# Altium schematic sheet DIGITAL_PART.SchDoc
size A3; SheetNumber: 1; SheetTotal: 2
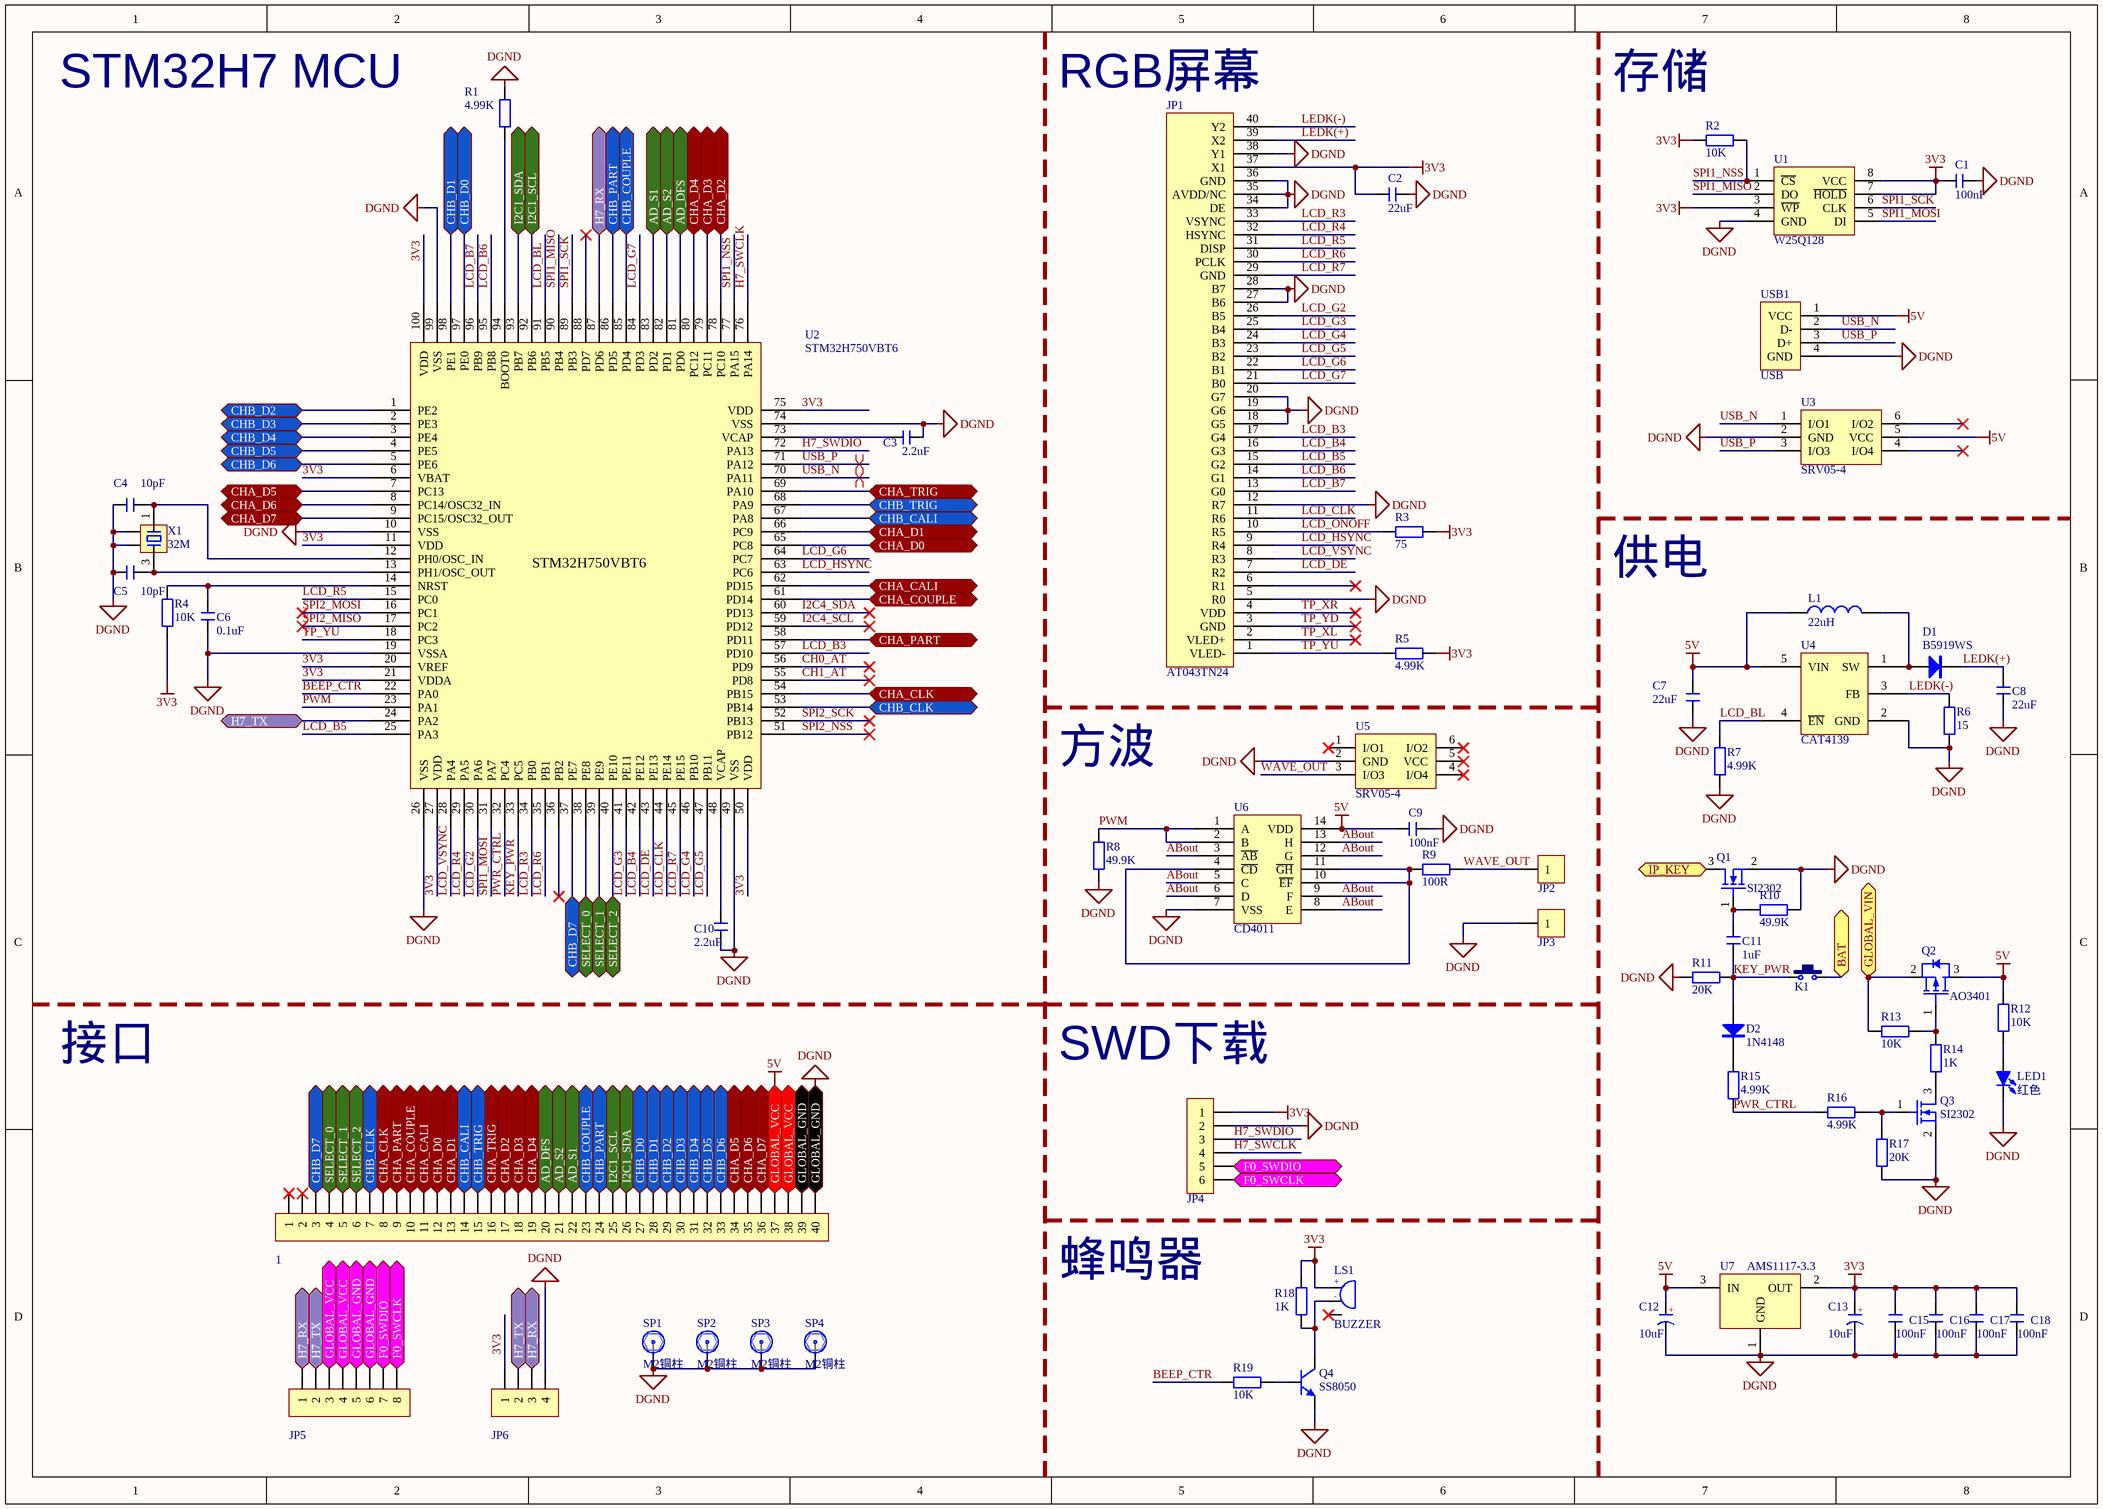
[diagram p0: DIGITAL_PART.SchDoc]

## Parts
1  FPC1.0-40P  [FPC0.5 2H-WS-40P]  (value not drawn)
C1  100nF  [C 0603_L]
C2  22uF  [C 0603_L]
C3  2.2uF  [C 0603_L]
C4  10pF  [C 0603_L]
C5  10pF  [C 0603_L]
C6  0.1uF  [C 0603_L]
C7  22uF  [C 0805_L]
C8  22uF  [C 0805_L]
C9  100nF  [C 0603_L]
C10  2.2uF  [C 0603_L]
C11  1uF  [C 0603_L]
C12  10uF  [CD A(3216)]
C13  10uF  [CD A(3216)]
C15  100nF  [C 0603_L]
C16  100nF  [C 0603_L]
C17  100nF  [C 0603_L]
C18  100nF  [C 0603_L]
D1  B5919WS  [SOD-323]
D2  1N4148  [SOD-523_L]
JP1  AT043TN24  [FPC0.5 2H-WS-40P]
JP2  冷压插片  [DJ610-4.8x0.5x14]  (value not drawn)
JP3  冷压插片  [DJ610-4.8x0.5x14]  (value not drawn)
JP4  HDR-1X6  [MX 1.25-WS-6P]  (value not drawn)
JP5  FPC1.0-8P  [FPC0.5 2H-WS-8P]  (value not drawn)
JP6  HDR-1X4  [HDR2.54-LI-4P]  (value not drawn)
K1  6x6x5  [TACT-SWITCH-3*6*3.5MM-SMD]  (value not drawn)
L1  22uH  [NR4020]
LED1  红色  [LED 0603G]
LS1  BUZZER  [BUZZER-5*5*2mm]
Q1  SI2302  [SOT23-3L]
Q2  AO3401  [SOT23-3L]
Q3  SI2302  [SOT23-3L]
Q4  SS8050  [SOT23-3N]
R1  4.99K  [R 0603_L]
R2  10K  [R 0603_L]
R3  75  [R 0603_L]
R4  10K  [R 0603_L]
R5  4.99K  [R 0603_L]
R6  15  [R 0603_L]
R7  4.99K  [R 0603_L]
R8  49.9K  [R 0603_L]
R9  100R  [R 0603_L]
R10  49.9K  [R 0603_L]
R11  20K  [R 0603_L]
R12  10K  [R 0603_L]
R13  10K  [R 0603_L]
R14  1K  [R 0603_L]
R15  4.99K  [R 0603_L]
R16  4.99K  [R 0603_L]
R17  20K  [R 0603_L]
R18  1K  [R 0603_L]
R19  10K  [R 0603_L]
SP1  M2铜柱  [M2]
SP2  M2铜柱  [M2]
SP3  M2铜柱  [M2]
SP4  M2铜柱  [M2]
U1  W25Q128  [SOP8W_L]
U2  STM32H750VBT6  [TQFP100 14x14_N]
U3  SRV05-4  [SOT-23-6M]
U4  CAT4139  [SOT23-5L]
U5  SRV05-4  [SOT-23-6M]
U6  CD4011  [SOP14_L]
U7  AMS1117-3.3  [SOT-223]
USB1  USB  [USB-A/S_C]
X1  32M  [OSC 2016-4P]

## Ports
AD_DFS (bidir), AD_S1 (bidir), AD_S2 (bidir), BAT (bidir), CHA_CALI (bidir), CHA_CLK (bidir), CHA_COUPLE (bidir), CHA_D0 (bidir), CHA_D1 (bidir), CHA_D2 (bidir), CHA_D3 (bidir), CHA_D4 (bidir), CHA_D5 (bidir), CHA_D6 (bidir), CHA_D7 (bidir), CHA_PART (bidir), CHA_TRIG (bidir), CHB_CALI (bidir), CHB_CLK (bidir), CHB_COUPLE (bidir), CHB_D0 (bidir), CHB_D1 (bidir), CHB_D2 (bidir), CHB_D3 (bidir), CHB_D4 (bidir), CHB_D5 (bidir), CHB_D6 (bidir), CHB_D7 (bidir), CHB_PART (bidir), CHB_TRIG (bidir), F0_SWCLK (bidir), F0_SWDIO (bidir), GLOBAL_GND (bidir), GLOBAL_VCC (bidir), GLOBAL_VIN (bidir), H7_RX (bidir), H7_TX (bidir), I2C1_SCL (bidir), I2C1_SDA (bidir), IP_KEY (bidir), SELECT_0 (bidir), SELECT_1 (bidir), SELECT_2 (bidir)

## Nets
3V3: C1.1 C2.1 C13.1(A) C15.2 C16.2 C17.2 C18.2 JP1.37(X1) JP4.1 JP6.1 LS1.1 R2.2 R3.1 R4.2 R5.1 R18.1 U1.3(~{WP}) U1.7(~{HOLD}) U1.8(VCC) U2.6(VBAT) U2.11(VDD) U2.20(VREF) U2.21(VDDA) U2.27(VDD) U2.50(VDD) U2.75(VDD) U2.100(VDD) U7.2(OUT)
5V: 1.37 1.38 C7.2 C9.2 C12.1(A) JP5.3 JP5.4 L1.1 Q2.3 R12.2 U3.5(VCC) U4.5(VIN) U6.14(VDD) U7.3(IN) USB1.1(VCC) ; port GLOBAL_VCC
DGND: 1.39 1.40 C1.2 C2.2 C3.2 C4.2 C5.2 C6.1 C7.1 C8.2 C9.1 C10.1 C12.2(K) C13.2(K) C15.1 C16.1 C17.1 C18.1 JP1.5(R0) JP1.12(R7) JP1.18(G5) JP1.19(G6) JP1.20(G7) JP1.27(B6) JP1.28(B7) JP1.34(DE) JP1.35(AVDD/NC) JP1.36(GND) JP1.38(Y1) JP3.1 JP4.2 JP5.5 JP5.6 JP6.4 LED1.2(K) Q1.2 Q3.2 Q4.2(E) R1.1 R6.1 R7.1 R8.2 R10.1 R11.2 R17.1 SP1.1 SP2.1 SP3.1 SP4.1 U1.4(GND) U2.10(VSS) U2.19(VSSA) U2.26(VSS) U2.49(VSS) U2.74(VSS) U2.99(VSS) U3.2(GND) U4.2(GND) U5.2(GND) U6.7(VSS) U7.1(GND) USB1.4(GND) X1.2 X1.4 ; port GLOBAL_GND
ABout: U6.3(~{AB}) U6.5(C) U6.6(D) U6.8(E) U6.9(F) U6.12(G) U6.13(H)
AD_DFS: 1.20 U2.81(PD0) ; port AD_DFS
AD_S1: 1.22 U2.83(PD2) ; port AD_S1
AD_S2: 1.21 U2.82(PD1) ; port AD_S2
BAT: K1.2 ; port BAT
BEEP_CTR: R19.1 U2.22(PA0)
CH0_AT: U2.56(PD9)
CH1_AT: U2.55(PD8)
CHA_CALI: 1.11 U2.62(PD15) ; port CHA_CALI
CHA_CLK: 1.8 U2.54(PB15) ; port CHA_CLK
CHA_COUPLE: 1.10 U2.61(PD14) ; port CHA_COUPLE
CHA_D0: 1.12 U2.65(PC8) ; port CHA_D0
CHA_D1: 1.13 U2.66(PC9) ; port CHA_D1
CHA_D2: 1.17 U2.78(PC10) ; port CHA_D2
CHA_D3: 1.18 U2.79(PC11) ; port CHA_D3
CHA_D4: 1.19 U2.80(PC12) ; port CHA_D4
CHA_D5: 1.34 U2.7(PC13) ; port CHA_D5
CHA_D6: 1.35 U2.8(PC14/OSC32_IN) ; port CHA_D6
CHA_D7: 1.36 U2.9(PC15/OSC32_OUT) ; port CHA_D7
CHA_PART: 1.9 U2.58(PD11) ; port CHA_PART
CHA_TRIG: 1.16 U2.69(PA10) ; port CHA_TRIG
CHB_CALI: 1.14 U2.67(PA8) ; port CHB_CALI
CHB_CLK: 1.7 U2.53(PB14) ; port CHB_CLK
CHB_COUPLE: 1.23 U2.85(PD4) ; port CHB_COUPLE
CHB_D0: 1.27 U2.97(PE0) ; port CHB_D0
CHB_D1: 1.28 U2.98(PE1) ; port CHB_D1
CHB_D2: 1.29 U2.1(PE2) ; port CHB_D2
CHB_D3: 1.30 U2.2(PE3) ; port CHB_D3
CHB_D4: 1.31 U2.3(PE4) ; port CHB_D4
CHB_D5: 1.32 U2.4(PE5) ; port CHB_D5
CHB_D6: 1.33 U2.5(PE6) ; port CHB_D6
CHB_D7: 1.3 U2.37(PE7) ; port CHB_D7
CHB_PART: 1.24 U2.86(PD5) ; port CHB_PART
CHB_TRIG: 1.15 U2.68(PA9) ; port CHB_TRIG
F0_SWCLK: JP4.6 JP5.8 ; port F0_SWCLK
F0_SWDIO: JP4.5 JP5.7 ; port F0_SWDIO
GLOBAL_VIN: Q2.2 R13.2 ; port GLOBAL_VIN
H7_RX: JP5.1 JP6.3 U2.87(PD6) ; port H7_RX
H7_SWCLK: JP4.4 U2.76(PA14)
H7_SWDIO: JP4.3 U2.72(PA13)
H7_TX: JP5.2 JP6.2 U2.24(PA2) ; port H7_TX
I2C1_SCL: 1.25 U2.92(PB6) ; port I2C1_SCL
I2C1_SDA: 1.26 U2.93(PB7) ; port I2C1_SDA
I2C4_SCL: U2.59(PD12)
I2C4_SDA: U2.60(PD13)
IP_KEY: Q1.3 ; port IP_KEY
KEY_PWR: C11.1 D2.1(A) K1.1 R11.1 U2.33(PC5)
LCD_B3: JP1.17(G4) U2.57(PD10)
LCD_B4: JP1.16(G3) U2.42(PE12)
LCD_B5: JP1.15(G2) U2.25(PA3)
LCD_B6: JP1.14(G1) U2.95(PB8)
LCD_B7: JP1.13(G0) U2.96(PB9)
LCD_BL: R7.2 U2.91(PB5) U4.4(~{EN})
LCD_CLK: JP1.11(R6) U2.44(PE14)
LCD_DE: JP1.7(R2) U2.43(PE13)
LCD_G2: JP1.26(B5) U2.30(PA6)
LCD_G3: JP1.25(B4) U2.41(PE11)
LCD_G4: JP1.24(B3) U2.46(PB10)
LCD_G5: JP1.23(B2) U2.47(PB11)
LCD_G6: JP1.22(B1) U2.64(PC7)
LCD_G7: JP1.21(B0) U2.84(PD3)
LCD_HSYNC: JP1.9(R4) U2.63(PC6)
LCD_ONOFF: JP1.10(R5) R3.2
LCD_R3: JP1.33(VSYNC) U2.34(PB0)
LCD_R4: JP1.32(HSYNC) U2.29(PA5)
LCD_R5: JP1.31(DISP) U2.15(PC0)
LCD_R6: JP1.30(PCLK) U2.35(PB1)
LCD_R7: JP1.29(GND) U2.45(PE15)
LCD_VSYNC: JP1.8(R3) U2.28(PA4)
LEDK(+): C8.1 D1.2(K) JP1.39(X2)
LEDK(-): JP1.40(Y2) R6.2 U4.3(FB)
PWM: R8.1 U2.23(PA1) U6.1(A) U6.2(B)
PWR_CTRL: R15.1 R16.2 U2.32(PC4)
SELECT_0: 1.4 U2.38(PE8) ; port SELECT_0
SELECT_1: 1.5 U2.39(PE9) ; port SELECT_1
SELECT_2: 1.6 U2.40(PE10) ; port SELECT_2
SPI1_MISO: U1.2(DO) U2.90(PB4)
SPI1_MOSI: U1.5(DI) U2.31(PA7)
SPI1_NSS: R2.1 U1.1(~{CS}) U2.77(PA15)
SPI1_SCK: U1.6(CLK) U2.89(PB3)
SPI2_MISO: U2.17(PC2)
SPI2_MOSI: U2.16(PC1)
SPI2_NSS: U2.51(PB12)
SPI2_SCK: U2.52(PB13)
TP_XL: JP1.2(VLED+)
TP_XR: JP1.4(VDD)
TP_YD: JP1.3(GND)
TP_YU: JP1.1(VLED-) R5.2 U2.18(PC3)
USB_N: U2.70(PA11) U3.1(I/O1) USB1.2(D-)
USB_P: U2.71(PA12) U3.3(I/O3) USB1.3(D+)
WAVE_OUT: JP2.1 R9.1 U5.3(I/O3)
NetC3_1: C3.1 U2.73(VCAP)
NetC4_1: C4.1 U2.12(PH0/OSC_IN) X1.1
NetC5_1: C5.1 U2.13(PH1/OSC_OUT) X1.3
NetC6_2: C6.2 R4.1 U2.14(NRST)
NetC10_2: C10.2 U2.48(VCAP)
NetC11_2: C11.2 Q1.1 R10.2
NetD1_1: D1.1(A) L1.2 U4.1(SW)
NetD2_2: D2.2(K) R15.2
NetLED1_1: LED1.1(A) R12.1
NetLS1_2: LS1.2 Q4.3(C) R18.2
NetQ2_1: Q2.1 R13.1 R14.2
NetQ3_1: Q3.1 R16.1 R17.2
NetQ3_3: Q3.3 R14.1
NetQ4_1: Q4.1(B) R19.2
NetR1_2: R1.2 U2.94(BOOT0)
NetR9_2: R9.2 U6.4(~{CD}) U6.10(~{EF}) U6.11(~{GH})

Not connected (* = marked no-connect by the designer): 1 1* 2*; JP1 6(R1)*; LS1 3*; U2 36(PB2)* 88(PD7)*; U3 4(I/O4)* 6(I/O2)*; U5 1(I/O1)* 4(I/O4)* 5(VCC)* 6(I/O2)*

## Layout directives
differential pair: USB_N, USB_P

## Notes on the sheet
- STM32H7 MCU
- RGB屏幕
- 存储
- 供电
- 方波
- 接口
- (near JP4) SWD下载
- 蜂鸣器
- (in symbol BUZZER) +; -
- (in symbol C-CD) +

## Library data of the parts
1 = FPC-40P: FPC连接器; 版权归属: 源创客; BOM名称: FPC连接器; 学习资源: www.ooocke.com
C1-C11 C15-C18 = C: 无极性贴片电容; 版权归属: 源创客; BOM名称: 无极性贴片电容; 学习资源: www.ooocke.com
C12 C13 = C-CD: 贴片钽电容; 版权归属: 源创客; BOM名称: 贴片钽电容; 学习资源: www.ooocke.com
D1 = 1N5819: 肖特基二极管; 版权归属: 源创客; 属性: 40V/2A; BOM名称: 肖特基二极管; 学习资源: www.ooocke.com
D2 = 1N4148: 高速开关二极管; 版权归属: 源创客; BOM名称: 高速开关二极管; 学习资源: www.ooocke.com
JP1 = AT043TN24: LED显示屏
JP2 JP3 = 冷压插片: BOM名称: 10P接插件; 版权归属: 源创客; 学习资源: www.ooocke.com
JP4 = Header 6: 6P接插件; 版权归属: 源创客; BOM名称: 6P接插件; 学习资源: www.ooocke.com
JP5 = FPC-8P: FPC连接器; 版权归属: 源创客; BOM名称: FPC连接器; 学习资源: www.ooocke.com
JP6 = Header 4: 4P接插件; 版权归属: 源创客; BOM名称: 4P接插件; 学习资源: www.ooocke.com
K1 = KEY-SMD-6x6: 贴片6x6轻触开关; 版权归属: 源创客; BOM名称: 贴片6x6轻触开关; 学习资源: www.ooocke.com
L1 = L: 小功率贴片电感; 版权归属: 源创客; BOM名称: 小功率贴片电感; 学习资源: www.ooocke.com
LED1 = LED-SMD: 贴片LED; 版权归属: 源创客; BOM名称: 贴片LED; 学习资源: www.ooocke.com
LS1 = BUZZER: 蜂鸣器; 版权归属: 源创客; BOM名称: 蜂鸣器; 学习资源: www.ooocke.com
Q1 Q3 = SI2302: 场效应管
Q2 = AO3401: P沟道MOS管
Q4 = 8050-SMD: 高频放大-NPN型; 版权归属: 源创客; 属性: 40V 1.5A 1W 100MHZ; BOM名称: 高频放大-NPN型; 学习资源: www.ooocke.com
R1-R19 = R: 贴片电阻; 版权归属: 源创客; BOM名称: 贴片电阻; 学习资源: www.ooocke.com
SP1-SP4 = M2铜柱: BOM名称: 铜柱; 版权归属: 源创客; 学习资源: www.ooocke.com
U1 = W25Q128: 外置Flash; 版权归属: 源创客; BOM名称: 外置Flash; 学习资源: www.ooocke.com
U2 = STM32H750VBT6_T: 微型控制器
U3 U5 = SRV05-4: TVS二极管
U4 = CAT4139: LED驱动
U6 = CD4011: 四二输入与非门
U7 = AMS1117-3.0: 线性稳压器
USB1 = USB-A/S: USB-A型母接口; 版权归属: 源创客; BOM名称: USB-A型母接口; 学习资源: www.ooocke.com
X1 = XTAL-4P: 4脚无源晶振; 版权归属: 源创客; BOM名称: 4脚无源晶振; 学习资源: www.ooocke.com